# Altium schematic sheet Moter_Control_2021-08-13.schdoc
size 431 x 309 mm; SheetNumber: 1; SheetTotal: 1
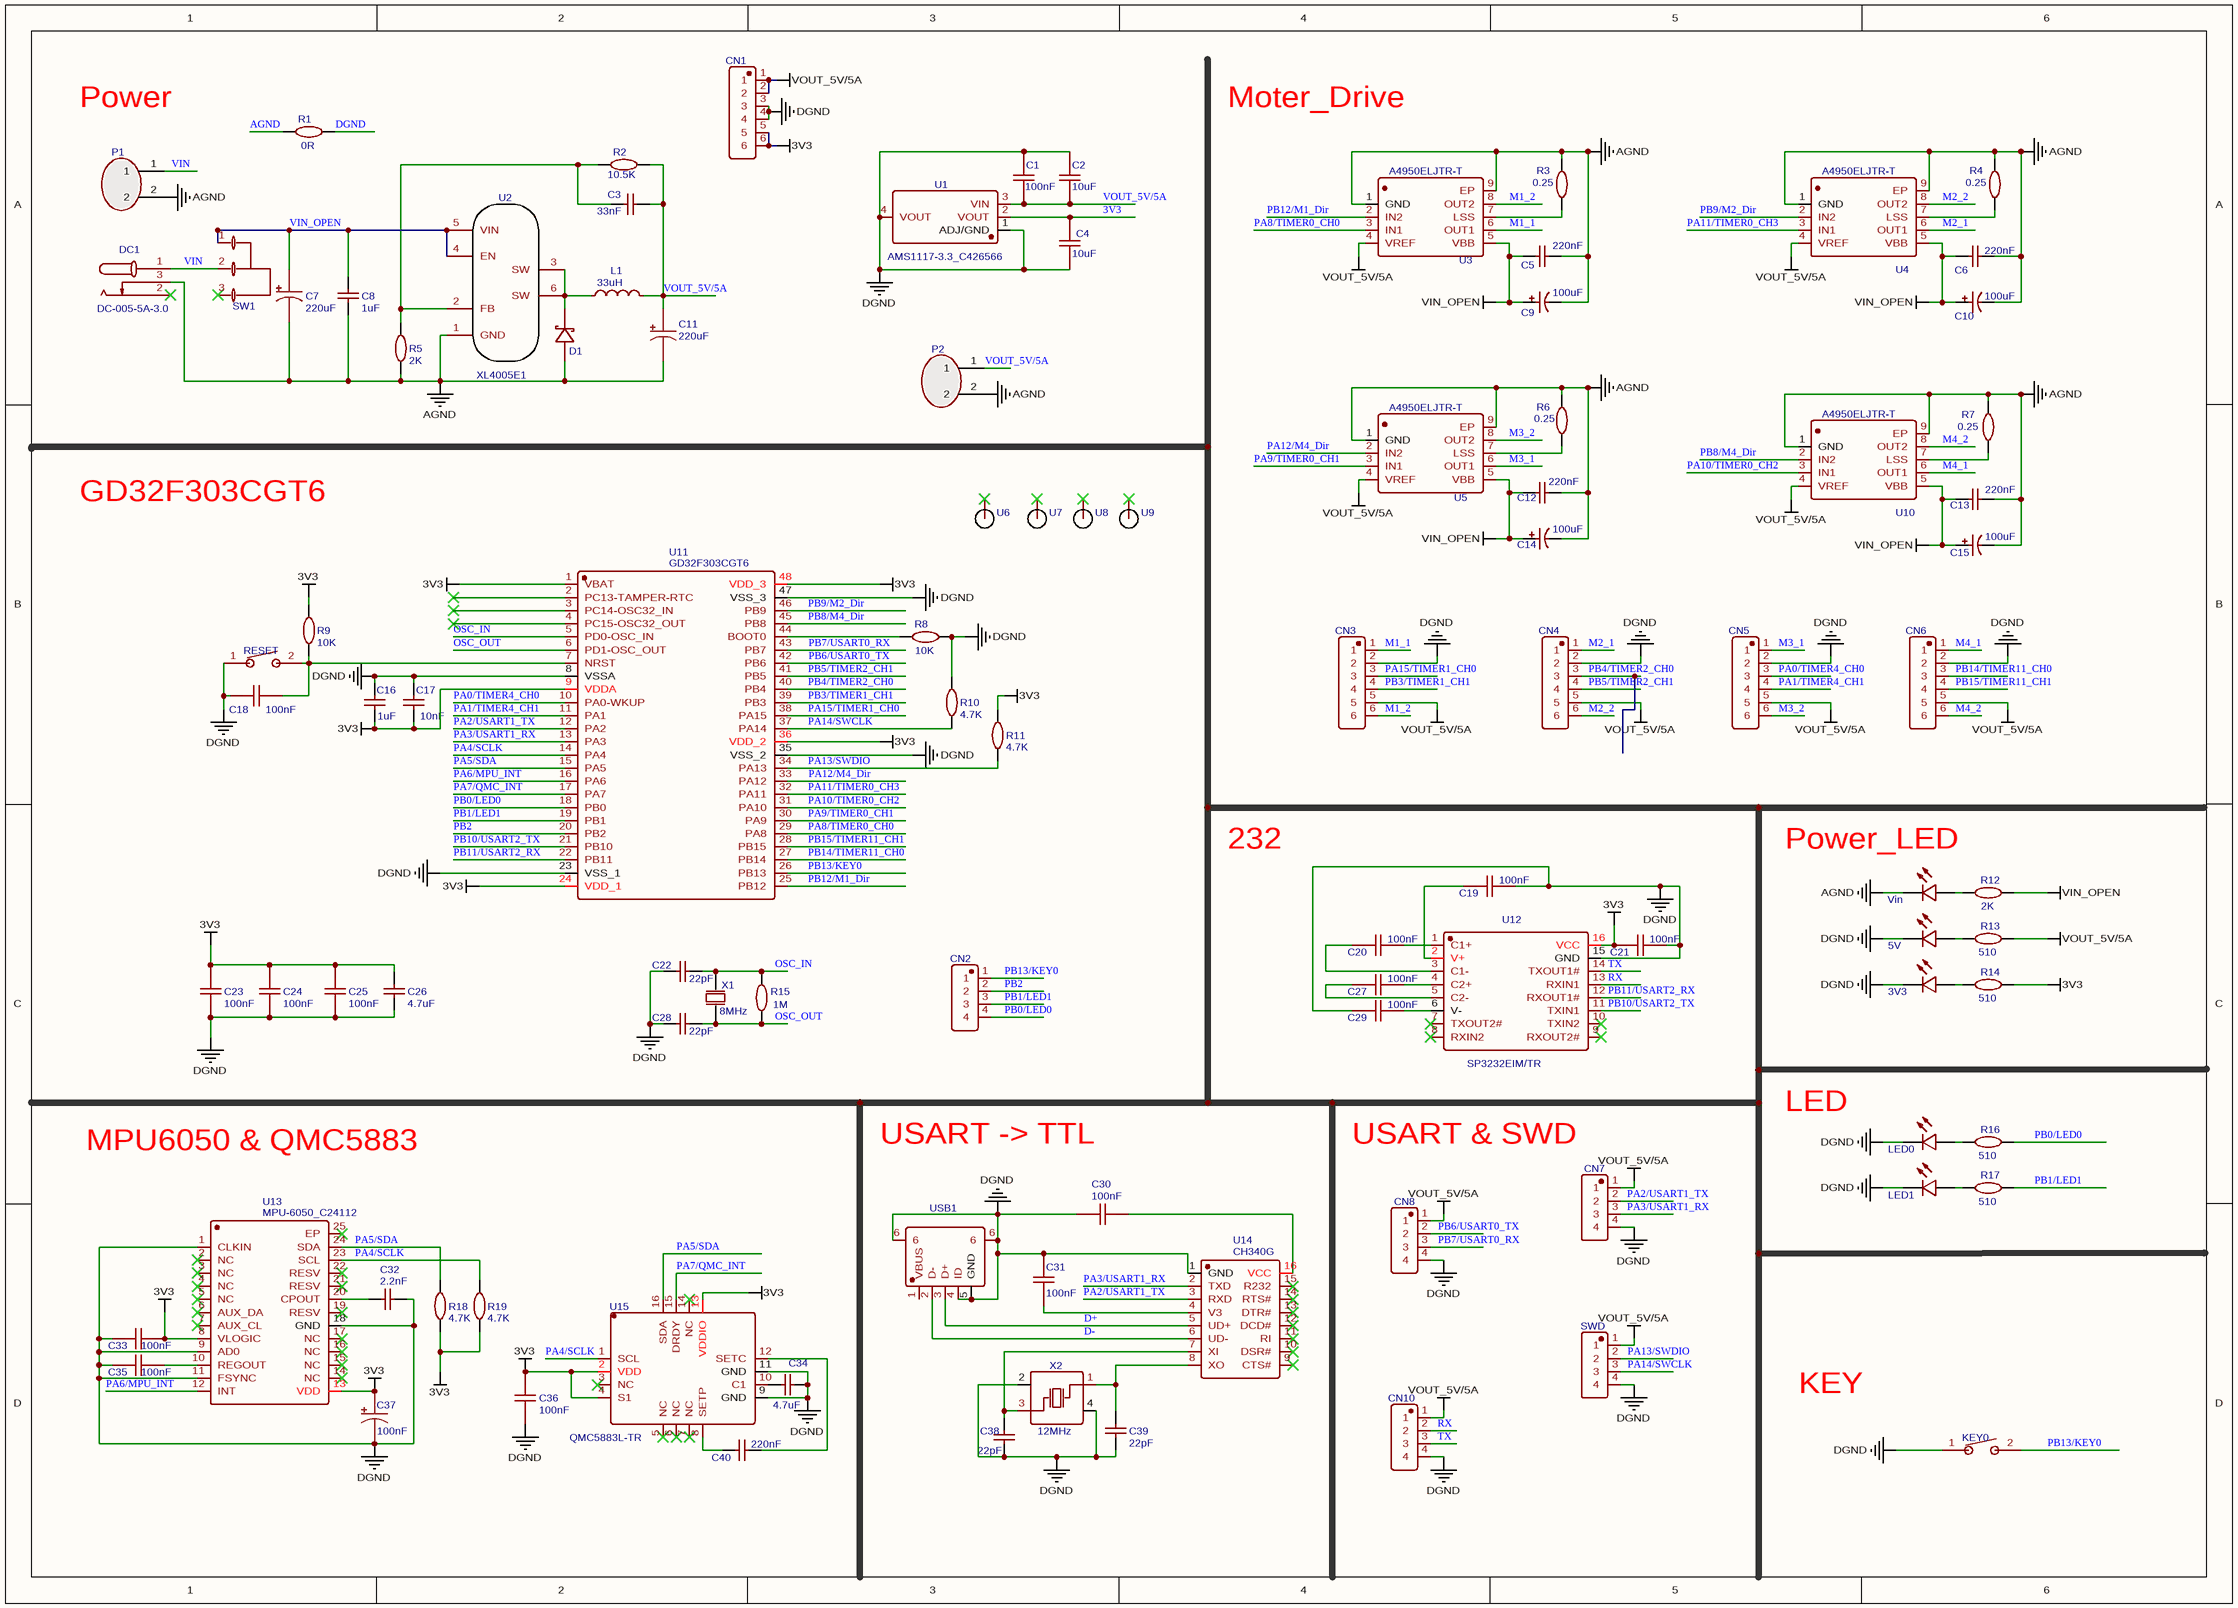
[diagram p0: Moter_Control_2021-08-13.schdoc]

## Parts
3V3  19-217/BHC-ZL1M2RY/3T  [LED0603_B]  (value not drawn)
5V  19-217/BHC-ZL1M2RY/3T  [LED0603_B]  (value not drawn)
C1  100nF  [C0603_L]
C2  10uF  [C0603_L]
C3  33nF  [C0603_L]
C4  10uF  [C0603_L]
C5  220nF  [C0603_L]
C6  220nF  [C0603_L]
C7  220uF  [CE E(8*10.2)]
C8  1uF  [C0603_L]
C9  100uF  [CE D(6.3*7.7)]
C10  100uF  [CE D(6.3*7.7)]
C11  220uF  [CE E(8*10.2)]
C12  220nF  [C0603_L]
C13  220nF  [C0603_L]
C14  100uF  [CE D(6.3*7.7)]
C15  100uF  [CE D(6.3*7.7)]
C16  1uF  [C0603_L]
C17  10nF  [C0603_L]
C18  100nF  [C0603_L]
C19  100nF  [C0603_L]
C20  100nF  [C0603_L]
C21  100nF  [C0603_L]
C22  22pF  [C0603_L]
C23  100nF  [C0603_L]
C24  100nF  [C0603_L]
C25  100nF  [C0603_L]
C26  4.7uF  [C0603_L]
C27  100nF  [C0603_L]
C28  22pF  [C0603_L]
C29  100nF  [C0603_L]
C30  100nF  [C0603_L]
C31  100nF  [C0603_L]
C32  2.2nF  [C0603_L]
C33  100nF  [C0603_L]
C34  4.7uF  [C0603_L]
C35  100nF  [C0603_L]
C36  100nF  [C0603_L]
C37  100nF  [CAP-SMD_L3.2-W1.6-R-RD]
C38  22pF  [C0603_L]
C39  22pF  [C0603_L]
C40  220nF  [C0603_L]
CN1  HX25003-6WAP  [Test_2.54_2×3Pin]  (value not drawn)
CN2  GP26-2520WV-4P  [Test_2.54_4Pin]  (value not drawn)
CN3  HX25003-6WAP  [XH2.54-WI-6P]  (value not drawn)
CN4  HX25003-6WAP  [XH2.54-WI-6P]  (value not drawn)
CN5  HX25003-6WAP  [XH2.54-WI-6P]  (value not drawn)
CN6  HX25003-6WAP  [XH2.54-WI-6P]  (value not drawn)
CN7  HX25035-4WAP  [Test_2.54_4Pin]  (value not drawn)
CN8  HX25035-4WAP  [XH2.54-WI-4P]  (value not drawn)
CN10  HX25035-4WAP  [XH2.54-WI-4P]  (value not drawn)
D1  SS54_C727065  [SMA_L4.3-W2.6-LS5.0-RD]  (value not drawn)
DC1  DC-005-5A-3.0  [DC-IN-TH_DC-005-5A-3.0]
KEY0  TSA363G25-250B  [SW-SMD_L6.5-W3.6-LS8.0]  (value not drawn)
L1  33uH  [IND-SMD_L13.45-W12.6]
LED0  19-217/BHC-ZL1M2RY/3T  [LED0603_B]  (value not drawn)
LED1  19-217/BHC-ZL1M2RY/3T  [LED0603_B]  (value not drawn)
P1  WJ126V-5.0-2P  [HT3.96-WI-2P-ORG]  (value not drawn)
P2  WJ126V-5.0-2P  [HT3.96-WI-2P-ORG]  (value not drawn)
R1  0R  [R0805_L]
R2  10.5K  [R0603_L]
R3  0.25  [R2512_L]
R4  0.25  [R2512_L]
R5  2K  [R0603_L]
R6  0.25  [R2512_L]
R7  0.25  [R2512_L]
R8  10K  [R0603_L]
R9  10K  [R0603_L]
R10  4.7K  [R0603_L]
R11  4.7K  [R0603_L]
R12  2K  [R0603_L]
R13  510  [R0603_L]
R14  510  [R0603_L]
R15  1M  [R0603_L]
R16  510  [R0603_L]
R17  510  [R0603_L]
R18  4.7K  [R0603_L]
R19  4.7K  [R0603_L]
RESET  TSA363G25-250B  [SW-SMD_L6.5-W3.6-LS8.0]  (value not drawn)
SW1  SS-12D06L5  [SS-12D10]  (value not drawn)
SWD  HX25035-4WAP  [Test_2.54_4Pin]  (value not drawn)
U1  AMS1117-3.3_C426566  [SOT-223_L6.5-W3.5-P2.30-LS7.0-BR]
U2  XL4005E1  [TO-263-5_L10.2-W9.2-P1.70-TL]
U3  A4950ELJTR-T  [A4950]
U4  A4950ELJTR-T  [A4950]
U5  A4950ELJTR-T  [A4950]
U6  Fix  [FIX]  (value not drawn)
U7  Fix  [FIX]  (value not drawn)
U8  Fix  [FIX]  (value not drawn)
U9  Fix  [FIX]  (value not drawn)
U10  A4950ELJTR-T  [A4950]
U11  GD32F303CGT6  [LQFP-48_L7.0-W7.0-P0.50-LS9.0-BL]
U12  SP3232EIM/TR  [SOP-16_L10.0-W3.9-P1.27-LS6.0-BL]
U13  MPU-6050_C24112  [QFN-24_L4.0-W4.0-P0.50-BL-EP2.6]
U14  CH340G  [SOIC-16_L9.9-W3.9-P1.27-LS6.0-BR]
U15  QMC5883L-TR  [SENSOR-SMD_QMC5883L-TR]
USB1  U-M-M5DS-W-5_C2689963  [USB-MICRO_D]  (value not drawn)
Vin  19-217/BHC-ZL1M2RY/3T  [LED0603_B]  (value not drawn)
X1  8MHz  [OSC 5032-2P-Black]
X2  12MHz  [OSC 3225-4P]

## Nets
3V3: C4.2 C16.1 C17.1 C21.2 C23.2 C24.2 C25.2 C26.2 C33.2 C36.2 C37.1 CN1.5 CN1.6 R9.2 R11.2 R14.2 R18.1 R19.1 U1.2(VOUT) U11.1(VBAT) U11.9(VDDA) U11.24(VDD_1) U11.36(VDD_2) U11.48(VDD_3) U12.16(VCC) U13.8(VLOGIC) U13.13(VDD) U15.2(VDD) U15.4(S1) U15.13(VDDIO)
AGND: C5.1 C6.1 C7.2 C8.2 C9.2 C10.2 C11.2 C12.1 C13.1 C14.2 C15.2 D1.2 DC1.3 P1.2 P2.2 R1.1 R3.1 R4.1 R5.1 R6.1 R7.1 U2.1(GND) U3.1(GND) U3.9(EP) U4.1(GND) U4.9(EP) U5.1(GND) U5.9(EP) U10.1(GND) U10.9(EP) Vin.2(C)
DGND: 3V3.2(C) 5V.2(C) C1.2 C2.2 C4.1 C16.2 C17.2 C18.1 C19.1 C21.1 C22.1 C23.1 C24.1 C25.1 C26.1 C28.1 C29.2 C30.2 C31.2 C32.2 C33.1 C34.2 C35.1 C36.1 C37.2 C38.1 C39.2 CN1.3 CN1.4 CN3.2 CN4.2 CN5.2 CN6.2 CN7.4 CN8.4 CN10.4 KEY0.1 LED0.2(C) LED1.2(C) R1.2 R8.2 R10.2 RESET.1 SWD.4 U1.1(ADJ/GND) U1.4(VOUT) U11.8(VSSA) U11.23(VSS_1) U11.35(VSS_2) U11.47(VSS_3) U12.15(GND) U13.1(CLKIN) U13.9(AD0) U13.11(FSYNC) U13.18(GND) U14.1(GND) U15.9(GND) U15.11(GND) USB1.4(ID) USB1.5(GND) USB1.6 X2.2(GND) X2.4(GND)
VIN_OPEN: C5.2 C6.2 C7.1 C8.1 C9.1 C10.1 C12.2 C13.2 C14.1 C15.1 R12.2 SW1.1 U2.4(EN) U2.5(VIN) U3.5(VBB) U4.5(VBB) U5.5(VBB) U10.5(VBB)
VOUT_5V/5A: C1.1 C2.1 C3.2 C11.1 CN1.1 CN1.2 CN3.5 CN4.5 CN5.5 CN6.5 CN7.1 CN8.1 CN10.1 L1.1 P2.1 R2.1 R13.2 SWD.1 U1.3(VIN) U3.4(VREF) U4.4(VREF) U5.4(VREF) U10.4(VREF)
D+: U14.5(UD+) USB1.3(D+)
D-: U14.6(UD-) USB1.2(D-)
M1_1: CN3.1 U3.6(OUT1)
M1_2: CN3.6 U3.8(OUT2)
M2_1: CN4.1 U4.6(OUT1)
M2_2: CN4.6 U4.8(OUT2)
M3_1: CN5.1 U5.6(OUT1)
M3_2: CN5.6 U5.8(OUT2)
M4_1: CN6.1 U10.6(OUT1)
M4_2: CN6.6 U10.8(OUT2)
OSC_IN: C22.2 R15.2 U11.5(PD0-OSC_IN) X1.2(OSC2)
OSC_OUT: C28.2 R15.1 U11.6(PD1-OSC_OUT) X1.1(OSC1)
PA0/TIMER4_CH0: CN5.3 U11.10(PA0-WKUP)
PA1/TIMER4_CH1: CN5.4 U11.11(PA1)
PA2/USART1_TX: CN7.2 U11.12(PA2) U14.3(RXD)
PA3/USART1_RX: CN7.3 U11.13(PA3) U14.2(TXD)
PA4/SCLK: R19.2 U11.14(PA4) U13.23(SCL) U15.1(SCL)
PA5/SDA: R18.2 U11.15(PA5) U13.24(SDA) U15.16(SDA)
PA6/MPU_INT: U11.16(PA6) U13.12(INT)
PA7/QMC_INT: U11.17(PA7) U15.15(DRDY)
PA8/TIMER0_CH0: U3.3(IN1) U11.29(PA8)
PA9/TIMER0_CH1: U5.3(IN1) U11.30(PA9)
PA10/TIMER0_CH2: U10.3(IN1) U11.31(PA10)
PA11/TIMER0_CH3: U4.3(IN1) U11.32(PA11)
PA12/M4_Dir: U5.2(IN2) U11.33(PA12)
PA13/SWDIO: R11.1 SWD.2 U11.34(PA13)
PA14/SWCLK: R10.1 SWD.3 U11.37(PA14)
PA15/TIMER1_CH0: CN3.3 U11.38(PA15)
PB0/LED0: CN2.4 R16.2 U11.18(PB0)
PB1/LED1: CN2.3 R17.2 U11.19(PB1)
PB2: CN2.2 U11.20(PB2)
PB3/TIMER1_CH1: CN3.4 U11.39(PB3)
PB4/TIMER2_CH0: CN4.3 U11.40(PB4)
PB5/TIMER2_CH1: CN4.4 U11.41(PB5)
PB6/USART0_TX: CN8.2 U11.42(PB6)
PB7/USART0_RX: CN8.3 U11.43(PB7)
PB8/M4_Dir: U10.2(IN2) U11.45(PB8)
PB9/M2_Dir: U4.2(IN2) U11.46(PB9)
PB10/USART2_TX: U11.21(PB10) U12.11(TXIN1)
PB11/USART2_RX: U11.22(PB11) U12.12(RXOUT1#)
PB12/M1_Dir: U3.2(IN2) U11.25(PB12)
PB13/KEY0: CN2.1 KEY0.2 U11.26(PB13)
PB14/TIMER11_CH0: CN6.3 U11.27(PB14)
PB15/TIMER11_CH1: CN6.4 U11.28(PB15)
RX: CN10.2 U12.13(RXIN1)
TX: CN10.3 U12.14(TXOUT1#)
VIN: DC1.1 P1.1 SW1.2
Net3V3_1: 3V3.1(A) R14.1
Net5V_1: 5V.1(A) R13.1
NetC3_1: C3.1 R2.2 R5.2 U2.2(FB)
NetC18_2: C18.2 R9.1 RESET.2 U11.7(NRST)
NetC19_2: C19.2 U12.2(V+)
NetC20_1: C20.1 U12.1(C1+)
NetC20_2: C20.2 U12.3(C1-)
NetC27_1: C27.1 U12.4(C2+)
NetC27_2: C27.2 U12.5(C2-)
NetC29_1: C29.1 U12.6(V-)
NetC30_1: C30.1 U14.16(VCC)
NetC31_1: C31.1 U14.4(V3)
NetC32_1: C32.1 U13.20(CPOUT)
NetC34_1: C34.1 U15.10(C1)
NetC35_2: C35.2 U13.10(REGOUT)
NetC38_2: C38.2 U14.7(XI) X2.3(OSC2)
NetC39_1: C39.1 U14.8(XO) X2.1(OSC1)
NetC40_1: C40.1 U15.8(SETP)
NetC40_2: C40.2 U15.12(SETC)
NetD1_1: D1.1 L1.2 U2.3(SW) U2.6(SW)
NetLED0_1: LED0.1(A) R16.1
NetLED1_1: LED1.1(A) R17.1
NetR3_2: R3.2 U3.7(LSS)
NetR4_2: R4.2 U4.7(LSS)
NetR6_2: R6.2 U5.7(LSS)
NetR7_2: R7.2 U10.7(LSS)
NetR8_1: R8.1 U11.44(BOOT0)
NetR12_1: R12.1 Vin.1(A)

Not connected (* = marked no-connect by the designer): DC1 2*; SW1 3*; U6 1*; U7 1*; U8 1*; U9 1*; U11 2(PC13-TAMPER-RTC)* 3(PC14-OSC32_IN)* 4(PC15-OSC32_OUT)*; U12 7(TXOUT2#)* 8(RXIN2)* 9(RXOUT2#)* 10(TXIN2)*; U13 2(NC)* 3(NC)* 4(NC)* 5(NC)* 6(AUX_DA)* 7(AUX_CL)* 14(NC)* 15(NC)* 16(NC)* 17(NC)* 19(RESV)* 21(RESV)* 22(RESV)* 25(EP)*; U14 9(CTS#)* 10(DSR#)* 11(RI)* 12(DCD#)* 13(DTR#)* 14(RTS#)* 15(R232)*; U15 3(NC)* 5(NC)* 6(NC)* 7(NC)* 14(NC)*; USB1 1(VBUS)

## Notes on the sheet
- Power
- Moter_Drive
- GD32F303CGT6
- 232
- (near Vin) Power_LED
- MPU6050 & QMC5883
- USART -> TTL
- USART & SWD
- LED
- KEY

## Library data of the parts
3V3 5V LED0 LED1 Vin = 19-217/BHC-ZL1M2RY/3T: BOM_Manufacturer: EVERLIGHT; BOM_Supplier: LCSC; BOM_Manufacturer Part: 19-217/BHC-ZL1M2RY/3T; BOM_Supplier Part: C72041; BOM_JLCPCB Part Class: Basic Part; spicePre: L; spiceSymbolName: 19-217/BHC-ZL1M2RY/3T
C1 C18-C21 C23-C25 C27 C29-C31 C33 C35 C36 = 100nF: BOM_Manufacturer: YAGEO; BOM_Manufacturer Part: CC0603KRX7R9BB104; nameAlias: Capacitance; BOM_Supplier: LCSC; BOM_Supplier Part: C14663; BOM_JLCPCB Part Class: Basic Part; spicePre: C; spiceSymbolName: CC0603KRX7R9BB104
C2 C4 = 10uF: BOM_Manufacturer: SAMSUNG; BOM_Manufacturer Part: CL10A106MA8NRNC; nameAlias: Capacitance; BOM_Supplier: LCSC; BOM_Supplier Part: C96446; BOM_JLCPCB Part Class: Extended Part; spicePre: C; spiceSymbolName: CL10A106MA8NRNC
C3 = 33nF: BOM_Manufacturer Part: CL10B333KB8NNNC; BOM_Manufacturer: SAMSUNG; nameAlias: Capacitance; BOM_Supplier: LCSC; BOM_Supplier Part: C21117; BOM_JLCPCB Part Class: Basic Part; spicePre: C; spiceSymbolName: CL10B333KB8NNNC
C5 C6 C12 C13 C40 = 220nF: BOM_Manufacturer Part: CL10B224KA8NNNC; BOM_Manufacturer: SAMSUNG; nameAlias: Capacitance; BOM_Supplier: LCSC; BOM_Supplier Part: C21120; BOM_JLCPCB Part Class: Basic Part; spicePre: C; spiceSymbolName: CL10B224KA8NNNC
C7 C11 = 470uF: BOM_Manufacturer: ROQANG; BOM_Manufacturer Part: RVT1H471M1213; nameAlias: Capacitance; BOM_Supplier: LCSC; BOM_Supplier Part: C90272; BOM_JLCPCB Part Class: Extended Part; spicePre: C; spiceSymbolName: RVT1H471M1213
C8 C16 = 1uF: BOM_Manufacturer Part: CL10A105KB8NNNC; BOM_Manufacturer: SAMSUNG; nameAlias: Capacitance; BOM_Supplier: LCSC; BOM_Supplier Part: C15849; BOM_JLCPCB Part Class: Basic Part; spicePre: C; spiceSymbolName: CL10A105KB8NNNC
C9 C10 C14 C15 = 100uF: BOM_Manufacturer: HONOR; BOM_Manufacturer Part: RVT1H101M0810; nameAlias: Capacitance; BOM_Supplier: LCSC; BOM_Supplier Part: C3352; BOM_JLCPCB Part Class: Extended Part; spicePre: C; spiceSymbolName: RVT1H101M0810
C17 = 10nF: BOM_Manufacturer: FH; BOM_Manufacturer Part: 0603B103K500NT; nameAlias: Capacitance; BOM_Supplier: LCSC; BOM_Supplier Part: C57112; BOM_JLCPCB Part Class: Basic Part; spicePre: C; spiceSymbolName: 0603B103K500NT
C22 C28 C38 C39 = 22pF: BOM_Manufacturer Part: CL10C220JB8NNNC; BOM_Manufacturer: SAMSUNG; nameAlias: Capacitance; BOM_Supplier: LCSC; BOM_Supplier Part: C1653; BOM_JLCPCB Part Class: Basic Part; spicePre: C; spiceSymbolName: CL10C220JB8NNNC
C26 C34 = 4.7uF: BOM_Manufacturer Part: CL10A475KO8NNNC; BOM_Manufacturer: SAMSUNG; nameAlias: Capacitance; BOM_Supplier: LCSC; BOM_Supplier Part: C19666; BOM_JLCPCB Part Class: Basic Part; spicePre: C; spiceSymbolName: CL10A475KO8NNNC
C32 = 2.2nF: BOM_Manufacturer: FH; BOM_Manufacturer Part: 0603B222K500NT; nameAlias: Capacitance; BOM_Supplier: LCSC; BOM_Supplier Part: C1604; BOM_JLCPCB Part Class: Basic Part; spicePre: C; spiceSymbolName: 0603B222K500NT
C37 = 100nF: BOM_Manufacturer: KEMET; BOM_Manufacturer Part: T491A104K035AT; nameAlias: Capacitance; Contributor: LCSC; BOM_Supplier: LCSC; BOM_Supplier Part: C122257; BOM_JLCPCB Part Class: Extended Part; spicePre: C; spiceSymbolName: T491A104K035AT
CN1 CN3-CN6 = HX25003-6WAP: BOM_Manufacturer: HX(Zhejiang Yueqing Hongxing Elec); Contributor: LCSC; BOM_Supplier: LCSC; BOM_Supplier Part: C442330; BOM_Manufacturer Part: HX25003-6WAP; BOM_JLCPCB Part Class: Extended Part; spicePre: C; spiceSymbolName: HX25003-6WAP
CN2 = GP26-2520WV-4P: BOM_Manufacturer: GEPU(歌普); Contributor: LCSC; BOM_Supplier: LCSC; BOM_Supplier Part: C2681739; BOM_Manufacturer Part: GP26-2520WV-4P; BOM_JLCPCB Part Class: Extended Part; spicePre: H; spiceSymbolName: GP26-2520WV-4P
CN7 CN8 CN10 SWD = HX25035-4WAP: BOM_Manufacturer: HX(Zhejiang Yueqing Hongxing Elec); Contributor: LCSC; BOM_Supplier: LCSC; BOM_Supplier Part: C442385; BOM_Manufacturer Part: HX25035-4WAP; BOM_JLCPCB Part Class: Extended Part; spicePre: C; spiceSymbolName: HX25035-4WAP
D1 = SS54_C727065: BOM_Manufacturer: TWGMC; BOM_Manufacturer Part: SS54; Contributor: LCSC; BOM_Supplier: LCSC; BOM_Supplier Part: C727065; BOM_JLCPCB Part Class: Extended Part; spicePre: D; spiceSymbolName: SS54_C727065
DC1 = DC-005-5A-3.0: BOM_Manufacturer: XKB Enterprise; Contributor: LCSC; BOM_Supplier: LCSC; BOM_Supplier Part: C388625; BOM_Manufacturer Part: DC-005-5A-3.0; BOM_JLCPCB Part Class: Extended Part; spicePre: D; spiceSymbolName: DC-005-5A-3.0
KEY0 RESET = TSA363G25-250B: BOM_Manufacturer: BRIGHT; Contributor: LCSC; BOM_Supplier: LCSC; BOM_Supplier Part: C354943; BOM_Manufacturer Part: TSA363G25-250B; BOM_JLCPCB Part Class: Extended Part; spicePre: S; spiceSymbolName: TSA363G25-250B
L1 = 33uH: BOM_Manufacturer: Sunlord; BOM_Manufacturer Part: MWSA1206S-330MT; nameAlias: Inductance; Contributor: LCSC; BOM_Supplier: LCSC; BOM_Supplier Part: C408530; BOM_JLCPCB Part Class: Extended Part; spicePre: L; spiceSymbolName: MWSA1206S-330MT
P1 P2 = WJ126V-5.0-2P: BOM_Manufacturer: ReliaPro; BOM_Supplier: LCSC; BOM_Manufacturer Part: WJ126V-5.0-2P; BOM_Supplier Part: C8404; BOM_JLCPCB Part Class: Extended Part; spicePre: P; spiceSymbolName: WJ126V-5.0-2P
R1 = 0R: BOM_Manufacturer: UniOhm; BOM_Manufacturer Part: 0603WAF0000T5E; nameAlias: Resistance (Ohms); BOM_Supplier: LCSC; BOM_Supplier Part: C21189; BOM_JLCPCB Part Class: Basic Part; spicePre: R; spiceSymbolName: 0603WAF0000T5E
R2 = 10.5K: BOM_Manufacturer: UniOhm; BOM_Manufacturer Part: 0603WAF1052T5E; nameAlias: Resistance (Ohms); BOM_Supplier: LCSC; BOM_Supplier Part: C22855; BOM_JLCPCB Part Class: Extended Part; spicePre: R; spiceSymbolName: 0603WAF1052T5E
R3 R4 R6 R7 = 0.25: BOM_Manufacturer: UniOhm; BOM_Manufacturer Part: 25121WF250LT4E; nameAlias: Resistance (Ohms); BOM_Supplier: LCSC; BOM_Supplier Part: C25467; BOM_JLCPCB Part Class: Extended Part; spicePre: R; spiceSymbolName: 25121WF250LT4E
R5 R12 = 2K: BOM_Manufacturer: UniOhm; BOM_Manufacturer Part: 0603WAF2001T5E; nameAlias: Resistance (Ohms); BOM_Supplier: LCSC; BOM_Supplier Part: C22975; BOM_JLCPCB Part Class: Basic Part; spicePre: R; spiceSymbolName: 0603WAF2001T5E
R8 R9 = 10K: BOM_Manufacturer: UniOhm; BOM_Manufacturer Part: 0603WAF1002T5E; nameAlias: Resistance (Ohms); BOM_Supplier: LCSC; BOM_Supplier Part: C25804; BOM_JLCPCB Part Class: Basic Part; spicePre: R; spiceSymbolName: 0603WAF1002T5E
R10 R11 = 4.7K: BOM_Manufacturer: YAGEO; BOM_Manufacturer Part: RC0603FR-074K7L; nameAlias: Resistance (Ohms); BOM_Supplier: LCSC; BOM_Supplier Part: C99782; BOM_JLCPCB Part Class: Extended Part; spicePre: R; spiceSymbolName: RC0603FR-074K7L
R13 R14 R16 R17 = 510: BOM_Manufacturer: UniOhm; BOM_Manufacturer Part: 0603WAF5100T5E; nameAlias: Resistance (Ohms); BOM_Supplier: LCSC; BOM_Supplier Part: C23193; BOM_JLCPCB Part Class: Basic Part; spicePre: R; spiceSymbolName: 0603WAF5100T5E
R15 = 1M: BOM_Manufacturer: UniOhm; BOM_Manufacturer Part: 0603WAF1004T5E; nameAlias: Resistance (Ohms); BOM_Supplier: LCSC; BOM_Supplier Part: C22935; BOM_JLCPCB Part Class: Basic Part; spicePre: R; spiceSymbolName: 0603WAF1004T5E
R18 R19 = 4.7K: BOM_Manufacturer: UniOhm; BOM_Manufacturer Part: 0603WAF4701T5E; nameAlias: Resistance (Ohms); BOM_Supplier: LCSC; BOM_Supplier Part: C23162; BOM_JLCPCB Part Class: Basic Part; spicePre: R; spiceSymbolName: 0603WAF4701T5E
SW1 = SS-12D06L5: BOM_Manufacturer: XKB Enterprise; Contributor: LCSC; BOM_Supplier: LCSC; BOM_Supplier Part: C319015; BOM_Manufacturer Part: SS-12D06L5; BOM_JLCPCB Part Class: Extended Part; spicePre: S; spiceSymbolName: SS-12D06L5
U1 = AMS1117-3.3_C426566: BOM_Manufacturer: SLKORMICRO Elec.; Contributor: LCSC; BOM_Supplier: LCSC; BOM_Supplier Part: C426566; BOM_Manufacturer Part: AMS1117-3.3; BOM_JLCPCB Part Class: Extended Part; spicePre: U; spiceSymbolName: AMS1117-3.3_C426566
U2 = XL4005E1: BOM_Manufacturer: XLSEMI; BOM_Supplier: LCSC; BOM_Manufacturer Part: XL4005E1; BOM_Supplier Part: C73332; BOM_JLCPCB Part Class: Extended Part; spicePre: U; spiceSymbolName: XL4005E1
U3-U5 U10 = A4950ELJTR-T: BOM_Manufacturer: ALLEGRO; BOM_Supplier: LCSC; BOM_Manufacturer Part: A4950ELJTR-T; BOM_Supplier Part: C82404; BOM_JLCPCB Part Class: Extended Part; spicePre: U; spiceSymbolName: A4950ELJTR-T
U6-U9 = Fix: Contributor: xdyewu; spicePre: U; spiceSymbolName: Fix
U11 = GD32F303CGT6: BOM_Manufacturer: GigaDevice(兆易创新); Contributor: LCSC; BOM_Supplier: LCSC; BOM_Supplier Part: C2835084; BOM_Manufacturer Part: GD32F303CGT6; spicePre: U; spiceSymbolName: GD32F303CGT6
U12 = SP3232EIM/TR: BOM_Manufacturer: HGSEMI; Contributor: LCSC; BOM_Supplier: LCSC; BOM_Supplier Part: C519088; BOM_Manufacturer Part: SP3232EIM/TR; BOM_JLCPCB Part Class: Extended Part; spicePre: U; spiceSymbolName: SP3232EIM/TR
U13 = MPU-6050_C24112: BOM_Manufacturer: InvenSense; sourceId: 1T5FDZYC8; timeStamp: 1462265206; BOM_Supplier: LCSC; BOM_Manufacturer Part: MPU-6050; BOM_Supplier Part: C24112; BOM_JLCPCB Part Class: Basic Part; spicePre: U; spiceSymbolName: MPU-6050_C24112
U14 = CH340G: BOM_Manufacturer: WCH; timeStamp: 1468327462; BOM_Supplier: LCSC; BOM_Manufacturer Part: CH340G; BOM_Supplier Part: C14267; BOM_JLCPCB Part Class: Basic Part; spicePre: U; spiceSymbolName: CH340G
U15 = QMC5883L-TR: BOM_Manufacturer: QST; Contributor: LCSC; BOM_Supplier: LCSC; BOM_Supplier Part: C192585; BOM_Manufacturer Part: QMC5883L-TR; BOM_JLCPCB Part Class: Extended Part; spicePre: U; spiceSymbolName: QMC5883L-TR
USB1 = U-M-M5DS-W-5_C2689963: BOM_Manufacturer: 韩国韩荣; Contributor: LCSC; BOM_Supplier: LCSC; BOM_Supplier Part: C2689963; BOM_Manufacturer Part: U-M-M5DS-W-5; BOM_JLCPCB Part Class: Extended Part; spicePre: U; spiceSymbolName: U-M-M5DS-W-5_C2689963
X1 = 8MHz: BOM_Manufacturer: YXC; BOM_Manufacturer Part: X50328MSB2GI; nameAlias: Frequency; BOM_Supplier: LCSC; BOM_Supplier Part: C115962; BOM_JLCPCB Part Class: Basic Part; spicePre: X; spiceSymbolName: X50328MSB2GI
X2 = 12MHz: BOM_Manufacturer: YXC; BOM_Manufacturer Part: X322512MSB4SI; nameAlias: Frequency; BOM_Supplier: LCSC; BOM_Supplier Part: C9002; BOM_JLCPCB Part Class: Basic Part; spicePre: X; spiceSymbolName: X322512MSB4SI